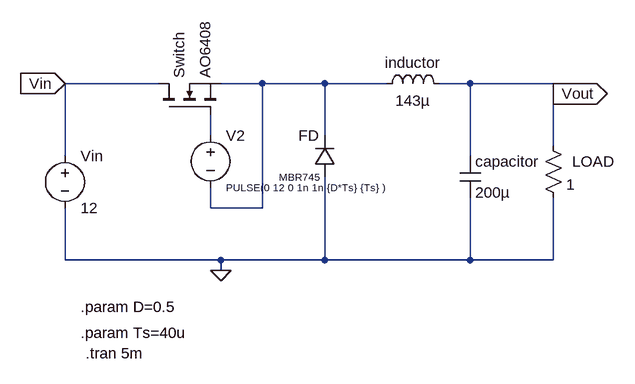
[diagram p0: schematic DC-DC Buck Converter.asc]
DC-DC Buck Converter.asc, the LTspice schematic file:
Version 4.1
SHEET 1 880 680
WIRE 112 16 -32 16
WIRE 272 16 208 16
WIRE 368 16 272 16
WIRE 464 16 368 16
WIRE 592 16 544 16
WIRE 720 16 592 16
WIRE 720 32 720 16
WIRE 192 96 192 64
WIRE 368 96 368 16
WIRE 720 112 720 32
WIRE -32 128 -32 16
WIRE 592 128 592 16
WIRE 192 208 192 176
WIRE 272 208 272 16
WIRE 272 208 192 208
WIRE -32 288 -32 208
WIRE 208 288 -32 288
WIRE 368 288 368 160
WIRE 368 288 208 288
WIRE 592 288 592 192
WIRE 592 288 368 288
WIRE 720 288 720 192
WIRE 720 288 592 288
WIRE 208 304 208 288
FLAG 208 304 0
FLAG -32 16 Vin
IOPIN -32 16 In
FLAG 720 32 Vout
IOPIN 720 32 Out
SYMBOL voltage -32 112 R0
WINDOW 123 0 0 Left 0
WINDOW 39 0 0 Left 0
SYMATTR InstName Vin
SYMATTR Value 12
SYMBOL nmos 112 64 R270
SYMATTR InstName Switch
SYMATTR Value AO6408
SYMBOL diode 384 160 R180
WINDOW 0 24 64 Left 2
WINDOW 3 24 0 Left 1
SYMATTR InstName FD
SYMATTR Value MBR745
SYMBOL res 704 96 R0
WINDOW 0 45 40 Left 2
SYMATTR InstName LOAD
SYMATTR Value 1
SYMBOL ind 448 32 R270
WINDOW 0 32 56 VTop 2
WINDOW 3 5 56 VBottom 2
SYMATTR InstName inductor
SYMATTR Value 143µ
SYMATTR SpiceLine Rser=1m
SYMBOL cap 576 128 R0
SYMATTR InstName capacitor
SYMATTR Value 200µ
SYMBOL voltage 192 80 R0
WINDOW 3 24 96 Left 1
WINDOW 123 0 0 Left 0
WINDOW 39 0 0 Left 0
SYMATTR Value PULSE(0 12 0 1n 1n {D*Ts} {Ts} )
SYMATTR InstName V2
TEXT -8 360 Left 2 !.param D=0.5
TEXT -8 400 Left 2 !.param Ts=40u
TEXT 0 432 Left 2 !.tran 5m

The netlist it stands for:
* DC-DC Buck Converter.asc
Vin Vin 0 12
M§Switch Vin N002 N001 N001 AO6408
D§FD 0 N001 MBR745
R§LOAD Vout 0 1
L§inductor N001 Vout 143µ Rser=1m
capacitor Vout 0 200µ
V2 N002 N001 PULSE(0 12 0 1n 1n {D*Ts} {Ts} )
.model D D
.lib standard.dio
.model NMOS NMOS
.model PMOS PMOS
.lib standard.mos
.param D=0.5
.param Ts=40u
.tran 5m
.backanno
.end